# EAGLE schematic 16*Vibrationdriver (EAGLE 7.2.0)
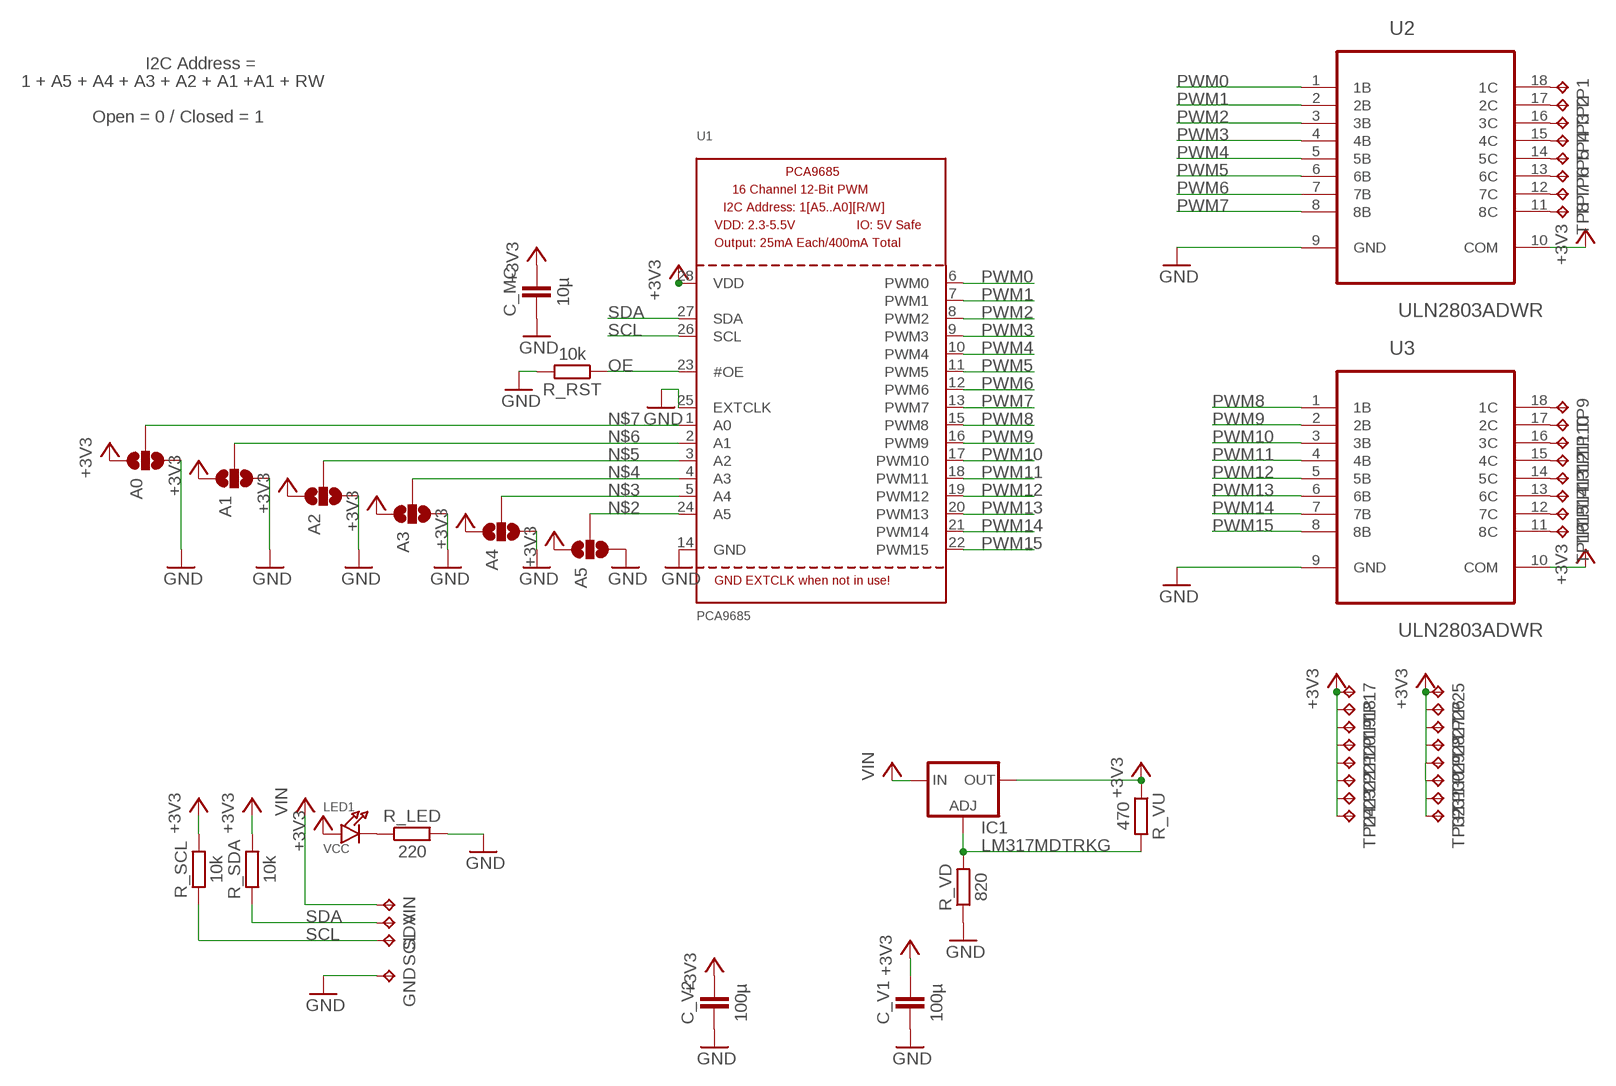
[diagram p0: schematic, sheet 1]

## Parts
A0  SOLDERJUMPER_2WAYPASTE2&3  [SJ_3_PASTE2&3]
A1  SOLDERJUMPER_2WAYPASTE2&3  [SJ_3_PASTE2&3]
A2  SOLDERJUMPER_2WAYPASTE2&3  [SJ_3_PASTE2&3]
A3  SOLDERJUMPER_2WAYPASTE2&3  [SJ_3_PASTE2&3]
A4  SOLDERJUMPER_2WAYPASTE2&3  [SJ_3_PASTE2&3]
A5  SOLDERJUMPER_2WAYPASTE2&3  [SJ_3_PASTE2&3]
C_MC  10µ  CAPACITOR  [603]
C_V1  100µ  CAPACITOR1206  [1206]
C_V2  100µ  CAPACITOR1206  [1206]
GND  TPTP16SQ  [TP16SQ]
IC1  LM317MDTRKG  [DPACK]
LED1  VCC  LED0805  [CHIPLED_0805]
R_LED  220  RESISTOR0603  [603]
R_RST  10k  RESISTOR0603  [603]
R_SCL  10k  RESISTOR0603  [603]
R_SDA  10k  RESISTOR0603  [603]
R_VD  820  RESISTOR0603  [603]
R_VU  470  RESISTOR0603  [603]
SCL  TPTP16SQ  [TP16SQ]
SDA  TPTP16SQ  [TP16SQ]
TP1  TPTP16SQ  [TP16SQ]
TP2  TPTP16SQ  [TP16SQ]
TP3  TPTP16SQ  [TP16SQ]
TP4  TPTP16SQ  [TP16SQ]
TP5  TPTP16SQ  [TP16SQ]
TP6  TPTP16SQ  [TP16SQ]
TP7  TPTP16SQ  [TP16SQ]
TP8  TPTP16SQ  [TP16SQ]
TP9  TPTP16SQ  [TP16SQ]
TP10  TPTP16SQ  [TP16SQ]
TP11  TPTP16SQ  [TP16SQ]
TP12  TPTP16SQ  [TP16SQ]
TP13  TPTP16SQ  [TP16SQ]
TP14  TPTP16SQ  [TP16SQ]
TP15  TPTP16SQ  [TP16SQ]
TP16  TPTP16SQ  [TP16SQ]
TP17  TPTP16SQ  [TP16SQ]
TP18  TPTP16SQ  [TP16SQ]
TP19  TPTP16SQ  [TP16SQ]
TP20  TPTP16SQ  [TP16SQ]
TP21  TPTP16SQ  [TP16SQ]
TP22  TPTP16SQ  [TP16SQ]
TP23  TPTP16SQ  [TP16SQ]
TP24  TPTP16SQ  [TP16SQ]
TP25  TPTP16SQ  [TP16SQ]
TP26  TPTP16SQ  [TP16SQ]
TP27  TPTP16SQ  [TP16SQ]
TP28  TPTP16SQ  [TP16SQ]
TP29  TPTP16SQ  [TP16SQ]
TP30  TPTP16SQ  [TP16SQ]
TP31  TPTP16SQ  [TP16SQ]
TP32  TPTP16SQ  [TP16SQ]
U1  PCA9685  [TSSOP28]
U2  ULN2803ADWR  [SOIC127P1030X265-18N]
U3  ULN2803ADWR  [SOIC127P1030X265-18N]
VIN  TPTP16SQ  [TP16SQ]

## Nets
+3V3: A0.1 A1.1 A2.1 A3.1 A4.1 A5.1 C_MC.2 C_V1.2 C_V2.2 IC1.4(OUT) LED1.A R_SCL.2 R_SDA.2 R_VU.1 TP17.TP TP18.TP TP19.TP TP20.TP TP21.TP TP22.TP TP23.TP TP24.TP TP25.TP TP26.TP TP27.TP TP28.TP TP29.TP TP30.TP TP31.TP TP32.TP U1.28(VDD) U2.10(COM) U3.10(COM)
GND: A0.3 A1.3 A2.3 A3.3 A4.3 A5.3 C_MC.1 C_V1.1 C_V2.1 GND.TP R_LED.2 R_RST.2 R_VD.1 U1.14(GND) U1.25(EXTCLK) U2.9(GND) U3.9(GND)
N$1: LED1.C R_LED.1
N$2: A5.2 U1.24(A5)
N$3: A4.2 U1.5(A4)
N$4: A3.2 U1.4(A3)
N$5: A2.2 U1.3(A2)
N$6: A1.2 U1.2(A1)
N$7: A0.2 U1.1(A0)
N$14: TP1.TP U2.18(1C)
N$18: IC1.1(ADJ) R_VD.2 R_VU.2
N$19: TP2.TP U2.17(2C)
N$20: TP3.TP U2.16(3C)
N$21: TP4.TP U2.15(4C)
N$22: TP5.TP U2.14(5C)
N$23: TP6.TP U2.13(6C)
N$24: TP7.TP U2.12(7C)
N$25: TP8.TP U2.11(8C)
N$26: TP9.TP U3.18(1C)
N$27: TP10.TP U3.17(2C)
N$28: TP11.TP U3.16(3C)
N$29: TP12.TP U3.15(4C)
N$30: TP13.TP U3.14(5C)
N$31: TP14.TP U3.13(6C)
N$32: TP15.TP U3.12(7C)
N$33: TP16.TP U3.11(8C)
OE: R_RST.1 U1.23(#OE)
PWM0: U1.6(PWM0) U2.1(1B)
PWM1: U1.7(PWM1) U2.2(2B)
PWM2: U1.8(PWM2) U2.3(3B)
PWM3: U1.9(PWM3) U2.4(4B)
PWM4: U1.10(PWM4) U2.5(5B)
PWM5: U1.11(PWM5) U2.6(6B)
PWM6: U1.12(PWM6) U2.7(7B)
PWM7: U1.13(PWM7) U2.8(8B)
PWM8: U1.15(PWM8) U3.1(1B)
PWM9: U1.16(PWM9) U3.2(2B)
PWM10: U1.17(PWM10) U3.3(3B)
PWM11: U1.18(PWM11) U3.4(4B)
PWM12: U1.19(PWM12) U3.5(5B)
PWM13: U1.20(PWM13) U3.6(6B)
PWM14: U1.21(PWM14) U3.7(7B)
PWM15: U1.22(PWM15) U3.8(8B)
SCL: R_SCL.1 SCL.TP U1.26(SCL)
SDA: R_SDA.1 SDA.TP U1.27(SDA)
VCC: IC1.3(IN) VIN.TP ; supply symbol labelled VIN

## Notes on the sheet
- I2C Address =
- 1 + A5 + A4 + A3 + A2 + A1 +A1 + RW
- Open = 0 / Closed = 1

## Library data of the parts
A0 A1-A5 = SparkFun-Retired:SOLDERJUMPER_2WAY: Solder Jumper 2 way solder jumper
C_MC C_V1 C_V2 = thar:CAPACITOR
GND SCL SDA TP1-TP32 VIN = testpad:TP: Test pad
IC1 = v-reg:LM317?*: 500 mA Adjustable Output Positive Voltage Regulator Source: http://www.onsemi.co.jp .. LM317M-D.PDF
LED1 = microbuilder:LED: LED 0603 - 0603 Surface Mount Package 2mA: Green LED - Low Power (3.9mcd, 2ma, 1.7Vf) - Digikey: 475-2709-2-ND Orange LED - Low Power (9.8mcd, 2ma, 1.8Vf) - Digikey: 475-1194-2-ND Red LED - Low Power (5mcd, 2ma, 1.8Vf) - Digikey: 475-1195-2-ND Yellow LED - Low Power (7mcd, 2ma, 1.8Vf) - Digikey: 475-1196-2-ND 5mA: Blue LED - Low Power (17mcd, 5ma, 2.9Vf) - Digikey: LNJ937W8CRACT-ND 0805 - 0805 Surface Mount Package 2mA: Red LED (8.8mcd, 2mA, 1.8Vf, Clear) - Low Power [Digikey: 475-2510-1-ND] Green LED (5mcd, 2mA, 1.8Vf, Clear) - Low Power [Digikey: 475-2730-1-ND] Yellow LED (11.3mcd, 2mA, 1.8Vf, Clear) - Low Power [Digikey: 475-2555-1-ND] 20mA: Red LED (104mcd, 20mA, Diffused) - LS R976 [Digikey: 475-1278-6-ND] Red LED (12mcd, 20mA, 2.0Vf, Clear) - APT2012EC [Digikey: 754-1128-1-ND] Green LED (15mcd, 20mA, 2.2Vf, Clear) - APT2012GC [Digikey: 754-1131-1-ND] Orange LED (160mcd, 20mA, 2.1Vf, Clear) - APT2012SECK [Digikey: 754-1130-1-ND] 1206 - 1206 Surface Mount Package Green LED (26mcd, 20mA, Diffused) - LG N971 [Digikey: 475-1407-6-ND] Red LED (15mcd, 20mA, Diffused) - LH N974 [Digikey: 475-1416-6-ND]
R_LED R_RST R_SCL R_SDA R_VD R_VU = thar:RESISTOR
U1 = microbuilder:PCA9685: PCA9685 - 16 Channel 12-Bit I2C PWM Controller 5.0V tolerant 16 channel, 12-bit I2C PWM controller with 25mA per output (max. 400mA total) Digikey: 568-5931-1-ND
U2 U3 = TI_ULN2803:ULN2803ADWR: Darlington transistor array; MPN: ULN2803ADWR; OC_FARNELL: 1652420; OC_NEWARK: 87H4769; PACKAGE: SOIC-18; SUPPLIER: TEXAS INSTRUMENTS